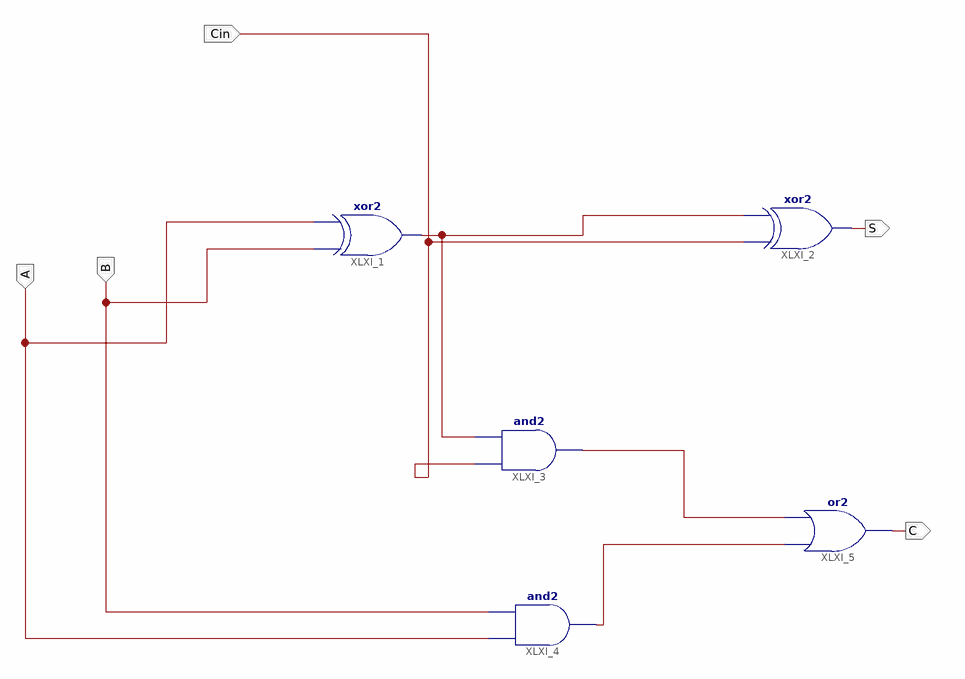
[diagram p0: schematic sheet 1]
// Xilinx ISE schematic asdasdasdssymb.sch (spartan3e) as structural Verilog: 5 symbols, 5 ports
module asdasdasdssymb (
  input  B,
  input  A,
  input  Cin,
  output S,
  output C
);

  wire XLXN_1, XLXN_5, XLXN_6;

  xor XLXI_1 (XLXN_1, B, A);
  xor XLXI_2 (S, Cin, XLXN_1);
  and XLXI_3 (XLXN_6, Cin, XLXN_1);
  and XLXI_4 (XLXN_5, A, B);
  or XLXI_5 (C, XLXN_5, XLXN_6);
endmodule
